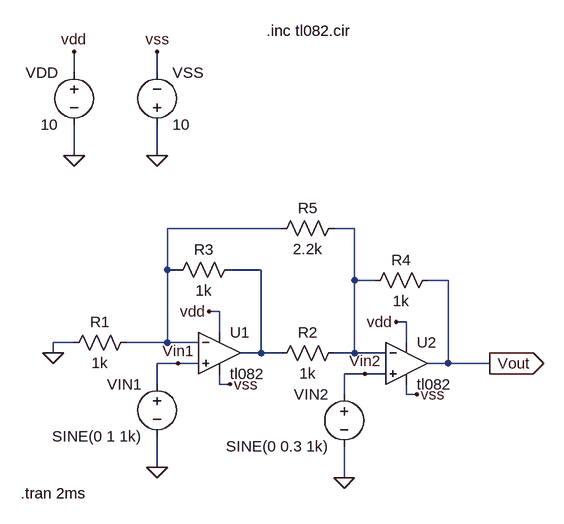
[diagram p0: schematic Instrum_verst_2opams.asc]
Instrum_verst_2opams.asc, the LTspice schematic file:
Version 4
SHEET 1 948 680
WIRE -64 -176 -64 -208
WIRE 64 -176 64 -208
WIRE -64 -48 -64 -96
WIRE 64 -48 64 -96
WIRE 256 64 80 64
WIRE 368 64 336 64
WIRE 80 128 80 64
WIRE 96 128 80 128
WIRE 224 128 176 128
WIRE 368 144 368 64
WIRE 400 144 368 144
WIRE 512 144 480 144
WIRE 160 192 144 192
WIRE 448 208 432 208
WIRE 160 224 160 192
WIRE -64 240 -96 240
WIRE 80 240 80 128
WIRE 80 240 16 240
WIRE 128 240 80 240
WIRE 448 240 448 208
WIRE -96 256 -96 240
WIRE 224 256 224 128
WIRE 224 256 192 256
WIRE 256 256 224 256
WIRE 368 256 368 144
WIRE 368 256 336 256
WIRE 416 256 368 256
WIRE 96 272 64 272
WIRE 128 272 96 272
WIRE 512 272 512 144
WIRE 512 272 480 272
WIRE 576 272 512 272
WIRE 384 288 352 288
WIRE 416 288 384 288
WIRE 64 304 64 272
WIRE 160 304 160 288
WIRE 176 304 160 304
WIRE 352 320 352 288
WIRE 448 320 448 304
WIRE 464 320 448 320
WIRE 64 432 64 384
WIRE 352 448 352 400
FLAG 64 432 0
FLAG -64 -48 0
FLAG 64 -48 0
FLAG -64 -208 vdd
FLAG 144 192 vdd
FLAG 64 -208 vss
FLAG 176 304 vss
FLAG 432 208 vdd
FLAG 464 320 vss
FLAG 96 272 Vin1
FLAG -96 256 0
FLAG 352 448 0
FLAG 384 288 Vin2
FLAG 576 272 Vout
IOPIN 576 272 Out
SYMBOL voltage 64 288 M0
WINDOW 123 0 0 Left 2
WINDOW 39 0 0 Left 2
SYMATTR InstName VIN1
SYMATTR Value SINE(0 1 1k)
SYMBOL voltage -64 -192 M0
SYMATTR InstName VDD
SYMATTR Value 10
SYMBOL voltage 64 -80 M180
WINDOW 0 24 96 Left 2
WINDOW 3 24 16 Left 2
SYMATTR InstName VSS
SYMATTR Value 10
SYMBOL Opamps\\opamp2 160 192 R0
SYMATTR InstName U1
SYMATTR Value tl082
SYMBOL Opamps\\opamp2 448 208 R0
SYMATTR InstName U2
SYMATTR Value tl082
SYMBOL res -80 256 R270
WINDOW 0 32 56 VTop 2
WINDOW 3 0 56 VBottom 2
SYMATTR InstName R1
SYMATTR Value 1k
SYMBOL res 240 272 R270
WINDOW 0 32 56 VTop 2
WINDOW 3 0 56 VBottom 2
SYMATTR InstName R2
SYMATTR Value 1k
SYMBOL res 80 144 R270
WINDOW 0 32 56 VTop 2
WINDOW 3 0 56 VBottom 2
SYMATTR InstName R3
SYMATTR Value 1k
SYMBOL res 384 160 R270
WINDOW 0 32 56 VTop 2
WINDOW 3 0 56 VBottom 2
SYMATTR InstName R4
SYMATTR Value 1k
SYMBOL res 240 80 R270
WINDOW 0 32 56 VTop 2
WINDOW 3 0 56 VBottom 2
SYMATTR InstName R5
SYMATTR Value 2.2k
SYMBOL voltage 352 304 M0
WINDOW 123 0 0 Left 2
WINDOW 39 0 0 Left 2
SYMATTR InstName VIN2
SYMATTR Value SINE(0 0.3 1k)
TEXT 232 -240 Left 2 !.inc tl082.cir
TEXT -146 472 Left 2 !.tran 2ms

The netlist it stands for:
* Instrum_verst_2opams.asc
VIN1 Vin1 0 SINE(0 1 1k)
VDD vdd 0 10
VSS 0 vss 10
XU1 Vin1 N001 vdd vss N003 tl082  ; pins In+ In- V+ V- OUT
XU2 Vin2 N002 vdd vss Vout tl082  ; pins In+ In- V+ V- OUT
R1 0 N001 1k
R2 N003 N002 1k
R3 N001 N003 1k
R4 N002 Vout 1k
R5 N001 N002 2.2k
VIN2 Vin2 0 SINE(0 0.3 1k)
.inc tl082.cir
.tran 2ms
.backanno
.end